# EAGLE design WallE (EAGLE 9.5.2)
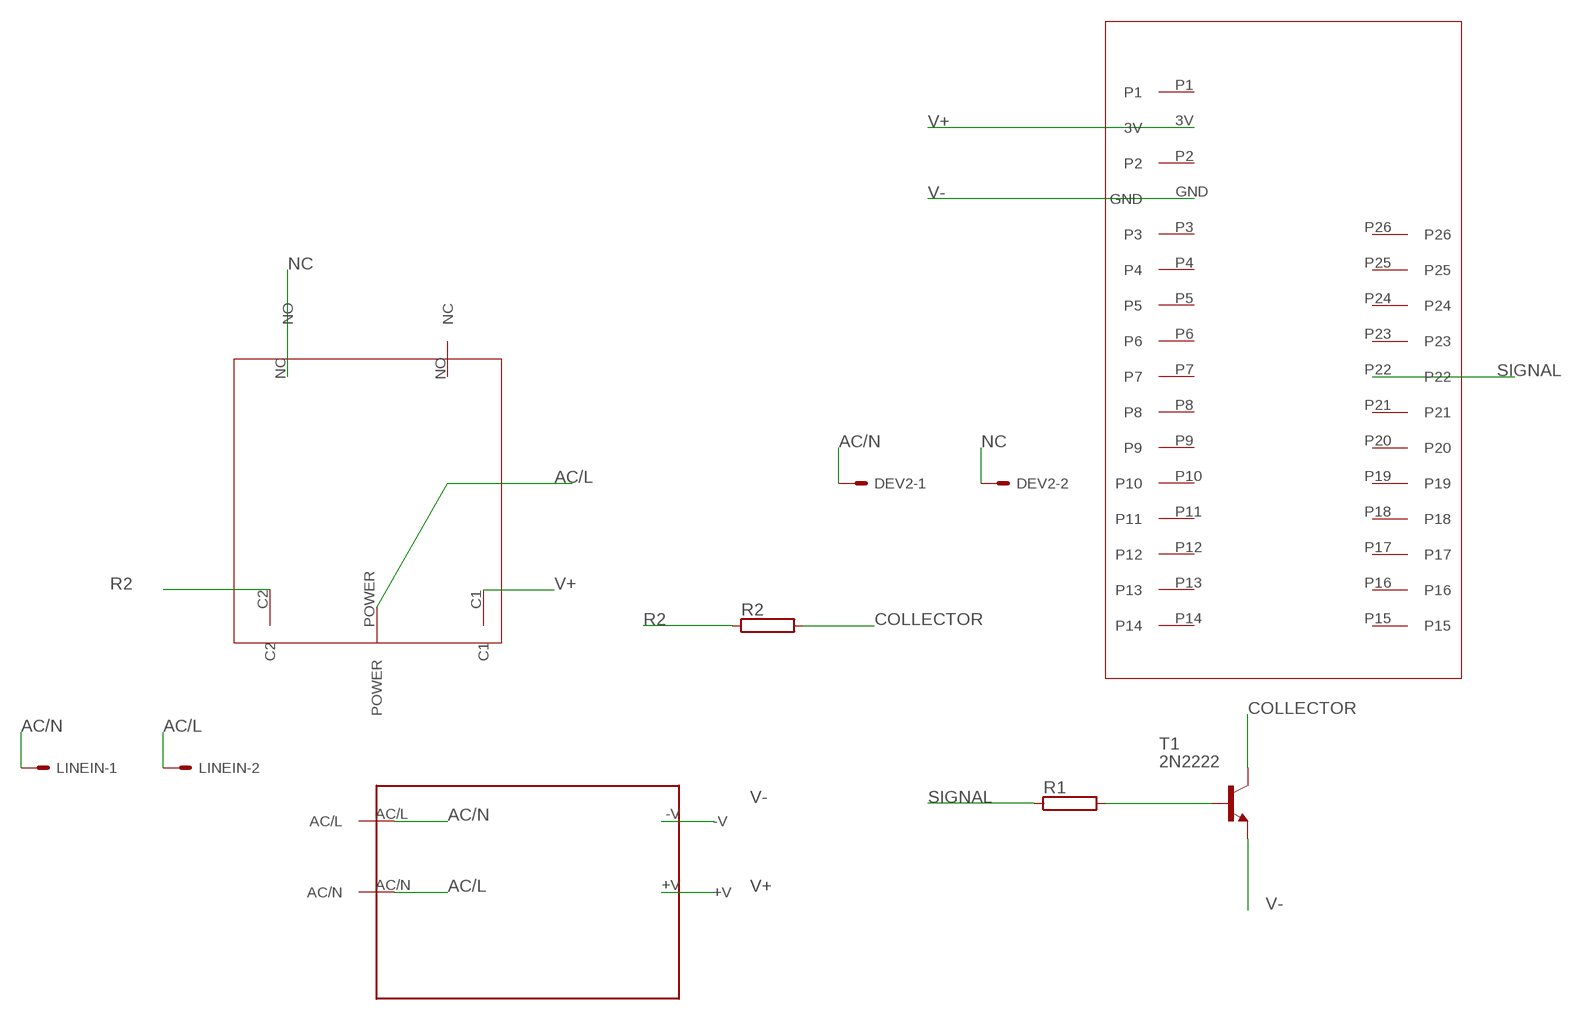
[diagram p0: schematic, sheet 1]

## Parts
DEV2  dev1  332-02  [332-02]
LINEIN  AC/L  332-02  [332-02]
R1  RMG100-V  [TO-247-2V]
R2  RMG100-V  [TO-247-2V]
T1  2N2222  [TO18]
U$1  POWER_COMPONENT  [POWER_COMPONENT]
U$2  3VUXCELLCOIL  [3VUXCELLRELAY]
U$3  ESP8266  [ESP8266]

## Nets
AC/L: LINEIN.2 U$1.AC/N U$2.POWER
AC/N: DEV2.1 LINEIN.1 U$1.AC/L
COLLECTOR: R2.2 T1.3(C)
N$1: R1.2 T1.2(B)
NC: DEV2.2 U$2.NC(NO)
R2: R2.1 U$2.C2
SIGNAL: R1.1 U$3.P22
V+: U$1.+V U$2.C1 U$3.3V
V-: T1.1(E) U$1.-V U$3.GND
Unconnected: U$2.NO(NC) U$3.P1 U$3.P2 U$3.P3 U$3.P4 U$3.P5 U$3.P6 U$3.P7 U$3.P8 U$3.P9 U$3.P10 U$3.P11 U$3.P12 U$3.P13 U$3.P14 U$3.P15 U$3.P16 U$3.P17 U$3.P18 U$3.P19 U$3.P20 U$3.P21 U$3.P23 U$3.P24 U$3.P25 U$3.P26

## Library data of the parts
DEV2 LINEIN = con-garry:332-02: 2 Pin - 2mm Dual Row Source: www.mpe-connector.de / garry_shortform_2012.pdf
R1 R2 = WallE_resistor-power:RMG100: TO-247 Power Resistor - RMG 100 Series Source: www.token.com.tw .. power-resistor-rmg100pdf; OC_FARNELL: unknown; OC_NEWARK: unknown
T1 = transistor:2N2222: NPN TRANSISTOR
U$1 = AC_DC_Component:POWER_COMPONENT
U$2 = uxcel3vrelay:3VUXCELLCOIL
U$3 = ESP8266:ESP8266

## Board
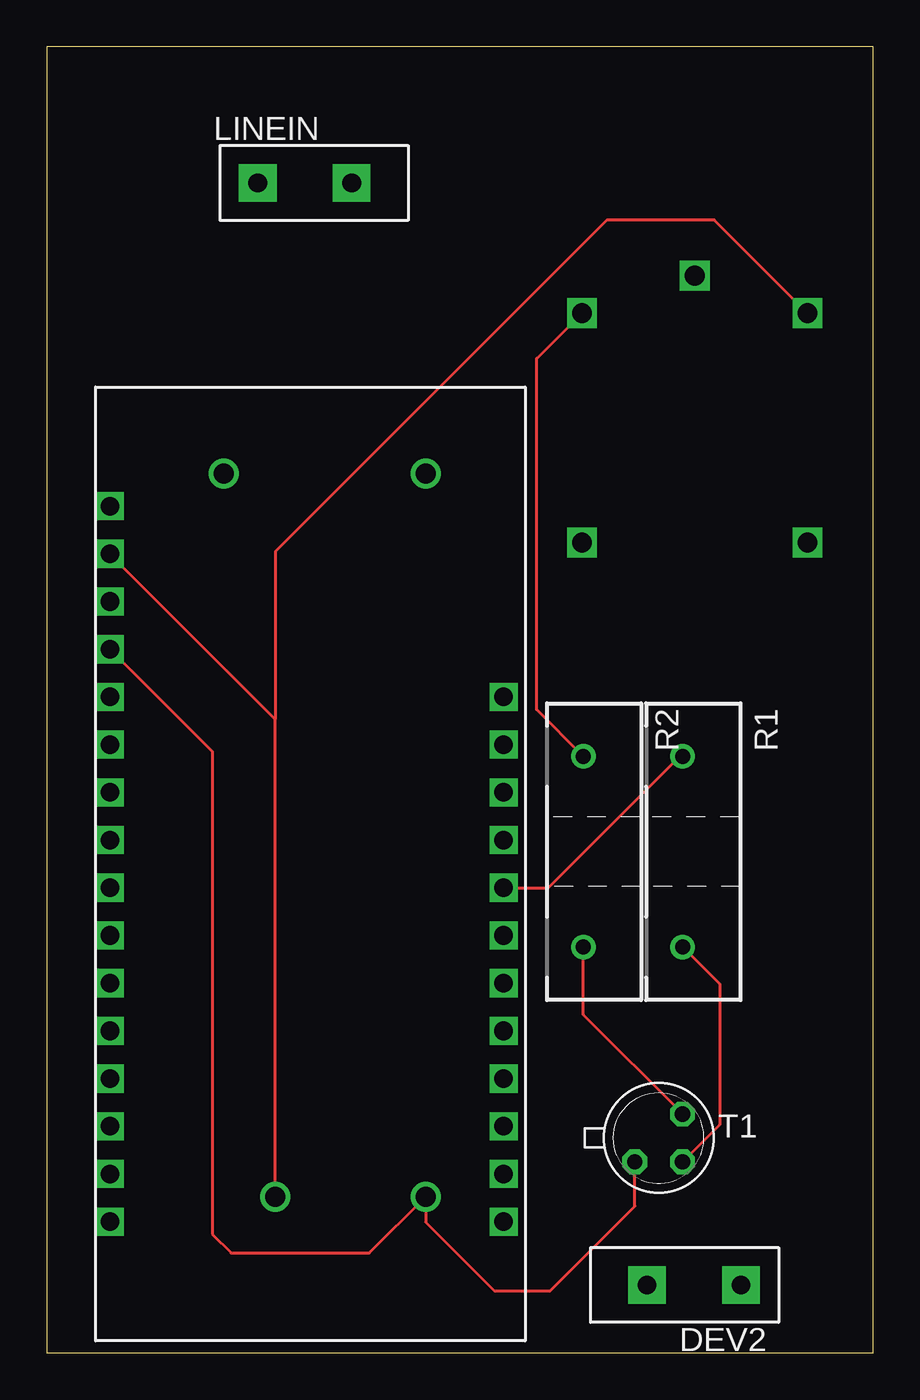
[diagram p1: board, top side]
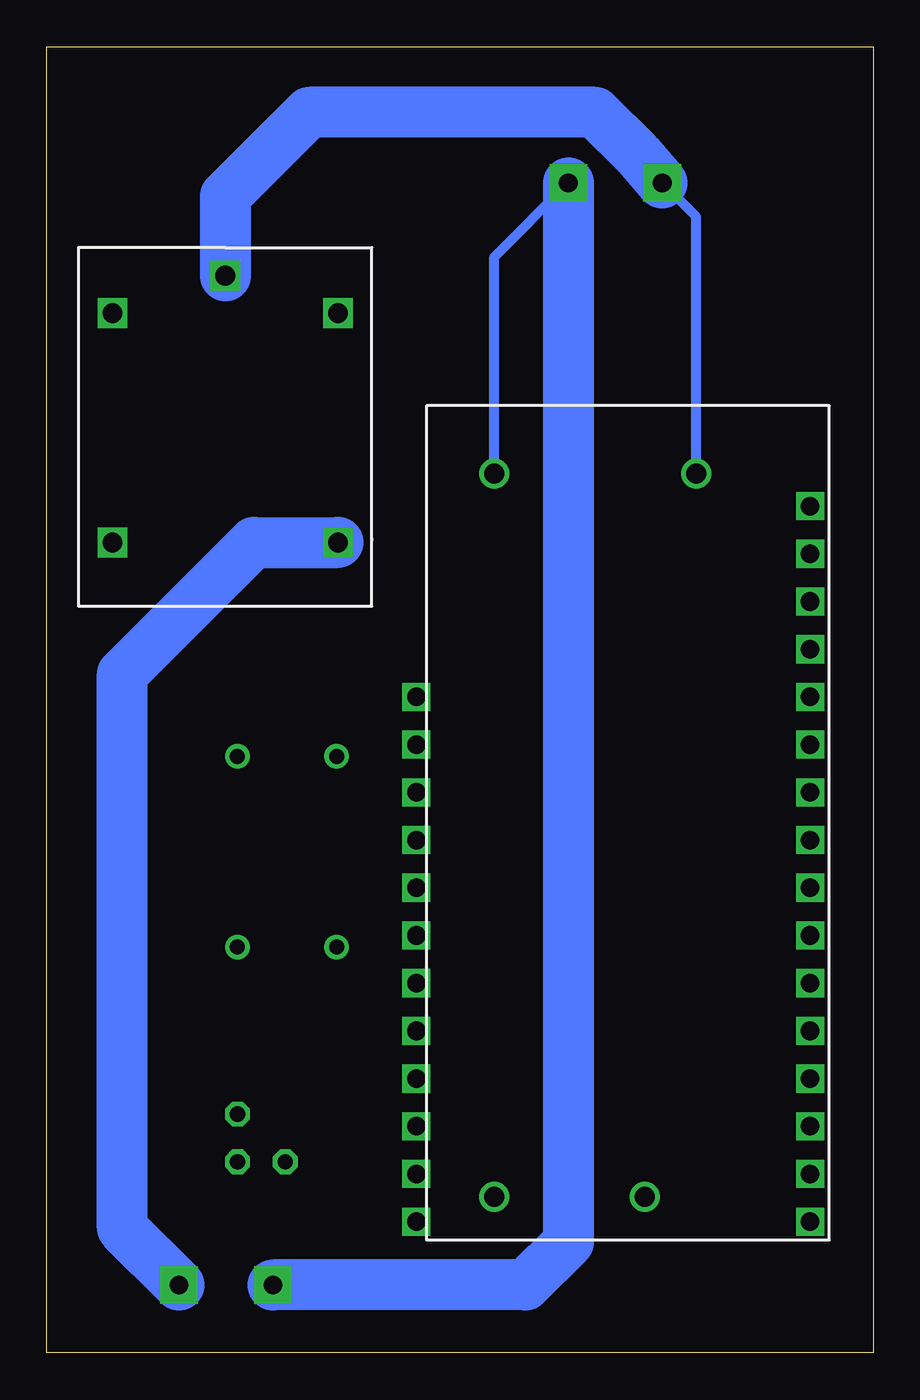
[diagram p2: board, bottom side, seen from below]

Size 43.97 x 69.52 mm. Coordinates in mm from the lower left corner, seen from the top.
Outline: 0,0 43.97,0 43.97,69.52 0,69.52 0,0
Copper layers (1*16): Top 0.035mm / dielectric 1.5mm / Bottom 0.035mm
Design rules "default": minimum track width 6mil, minimum drill 0.35mm, track to track 6mil, track to pad 6mil, pad to pad 6mil, via to via 6mil, smd to smd 6mil, copper to edge 40mil, drill to drill 6mil, minimum pad ring 10mil, minimum via ring 8mil, stop-mask expansion 4mil, vias tented up to drill 0mil, thermal gap 10mil

### Footprints (pad centres in the part's own frame; a part is rotated, then mirrored left to right if it is on the bottom)
332-02 = drill 1 pad 2 square: 1 -2.35,-0.27; 2 2.65,-0.27
TO-247-2V = drill 0.8: 1 -5.08,0; 2 5.08,0
TO18 = drill 0.813 octagon: 1 -1.27,-1.27; 2 1.27,-1.27; 3 1.27,1.27
POWER_COMPONENT = drill 1.06: +V 8,-38.5; -V 0,-38.5; AC/L 0,0; AC/N 10.75,0
3VUXCELLRELAY = drill 1.06 square: C1 0,0; C2 -12,0; NC -12,12.2; NO 0,12.2; POWER -6,-2
ESP8266 = drill 0.991 square: 3V 0,17.78; GND 0,12.7; P1 0,20.32; P2 0,15.24; P3 0,10.16; P4 0,7.62; P5 0,5.08; P6 0,2.54; P7 0,0; P8 0,-2.54; P9 0,-5.08; P10 0,-7.62; P11 0,-10.16; P12 0,-12.7; P13 0,-15.24; P14 0,-17.78; P15 20.955,-17.78; P16 20.955,-15.24; P17 20.955,-12.7; P18 20.955,-10.16; P19 20.955,-7.62; P20 20.955,-5.08; P21 20.955,-2.54; P22 20.955,0; P23 20.955,2.54; P24 20.955,5.08; P25 20.955,7.62; P26 20.955,10.16

### Placement (x,y rotation side)
DEV2  34.29,3.87 0 top
LINEIN  13.87,62.01 180 top
R1  33.83,26.67 270 top
R2  28.55,26.67 270 top
T1  32.56,11.43 0 top
U$1  20.16,46.8 0 bottom
U$2  40.48,55.34 180 bottom
U$3  3.35,24.75 0 top

### Tracks (layer width: path | path; a pad name or v marks a point on that pad's centre or on a via)
AC/L
  Bottom 0.532: U$1.AC/N 9.41,60.47 LINEIN.2
  Bottom 2.71: LINEIN.2 12.51,63.77 14.78,66.04 30.02,66.04 34.48,61.58 U$2.POWER
AC/N
  Bottom 0.532: U$1.AC/L 20.16,58.34 LINEIN.1
  Bottom 2.71: DEV2.1 18.5,3.6 16.22,5.88 LINEIN.1
COLLECTOR
  Top 0.152: T1.3 28.55,17.98 R2.2
N$1
  Top 0.152: R1.2 35.8,19.62 35.8,12.13 T1.2
NC
  Bottom 2.71: DEV2.2 39.96,6.62 39.96,36.14 32.96,43.14 U$2.NC
R2
  Top 0.152: R2.1 26.07,34.23 26.07,52.93 U$2.C2
SIGNAL
  Top 0.152: R1.1 33.73,31.8 26.68,24.75 U$3.P22
V+
  Top 0.152: U$2.C1 35.52,60.3 29.8,60.3 12.16,42.66 12.16,33.72 | U$1.+V 12.16,33.72 | 12.16,33.72 U$3.3V
V-
  Top 0.152: T1.1 31.29,7.79 26.8,3.3 23.8,3.3 20.16,6.94 U$1.-V 17.16,5.3 9.8,5.3 8.8,6.3 8.8,32 U$3.GND